# EAGLE design power-v2 (EAGLE 5.11)
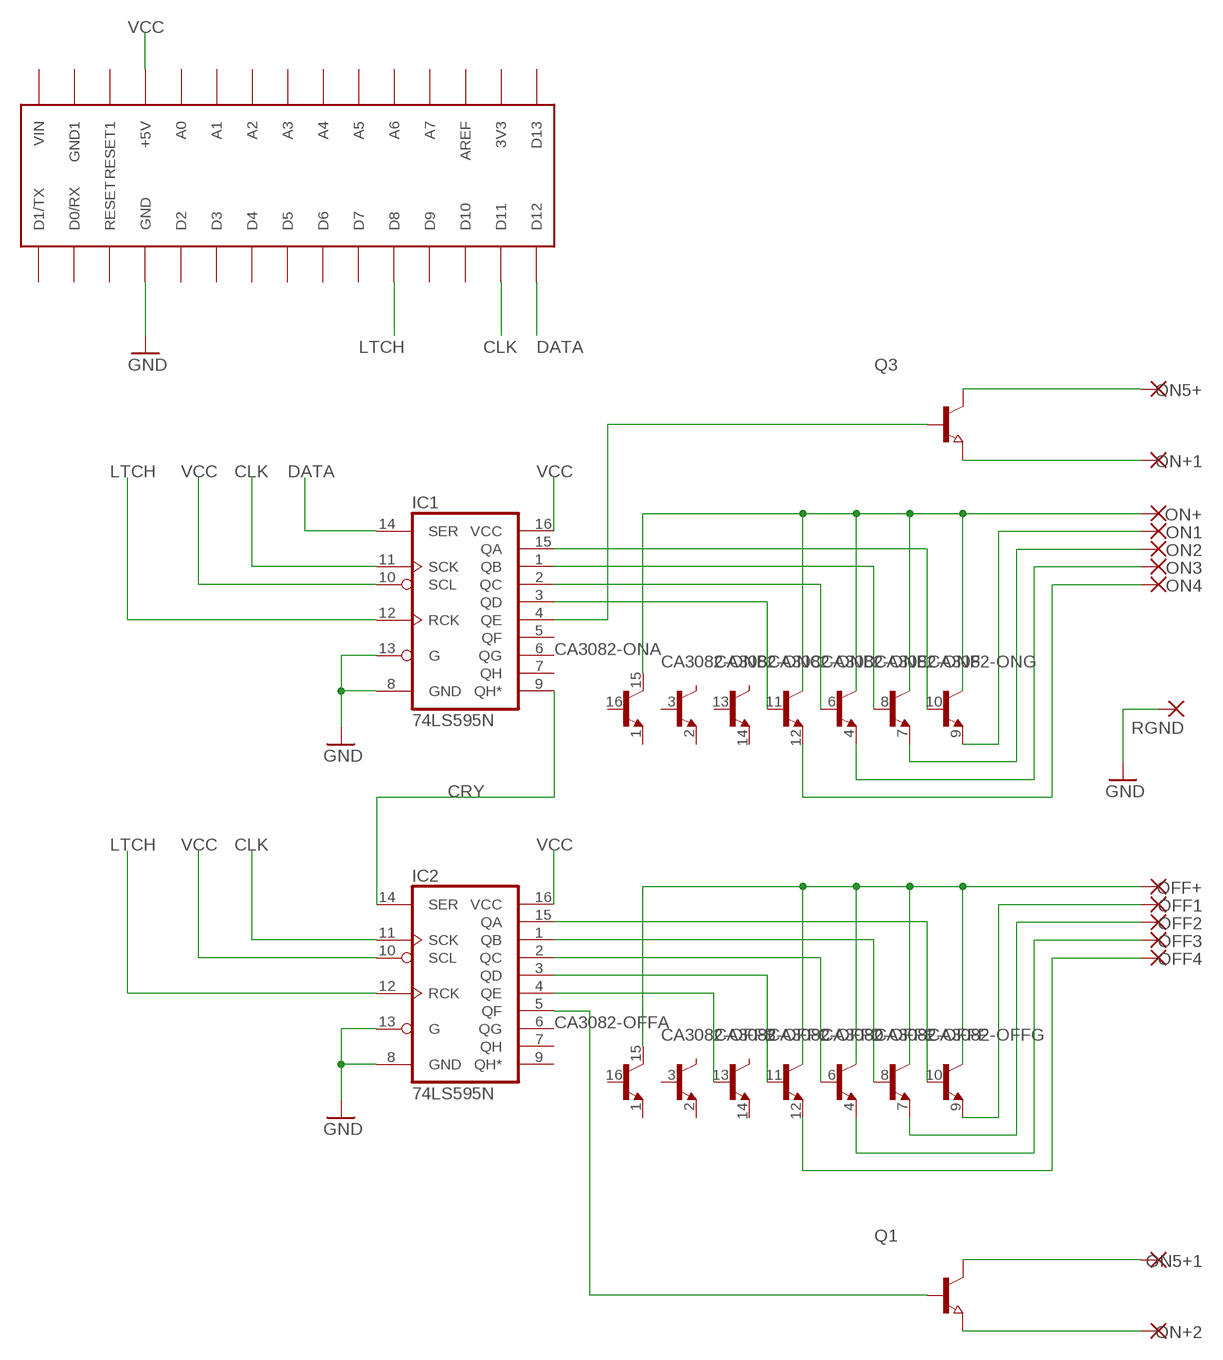
[diagram p0: schematic, sheet 1]

## Parts
CA3082-OFF  CA3082  [DIL16]
CA3082-ON  CA3082  [DIL16]
IC1  74LS595N  [DIL16]
IC2  74LS595N  [DIL16]
OFF1  1,6/0,8  [1,6/0,8]
OFF2  1,6/0,8  [1,6/0,8]
OFF3  1,6/0,8  [1,6/0,8]
OFF4  1,6/0,8  [1,6/0,8]
OFF+  1,6/0,8  [1,6/0,8]
ON1  1,6/0,8  [1,6/0,8]
ON2  1,6/0,8  [1,6/0,8]
ON3  1,6/0,8  [1,6/0,8]
ON4  1,6/0,8  [1,6/0,8]
ON5+  1,6/0,8  [1,6/0,8]
ON5+1  1,6/0,8  [1,6/0,8]
ON+  1,6/0,8  [1,6/0,8]
ON+1  1,6/0,8  [1,6/0,8]
ON+2  1,6/0,8  [1,6/0,8]
Q1  NPN-TRANSISTOR_SOT23  [SOT23]
Q3  NPN-TRANSISTOR_SOT23  [SOT23]
RGND  1,6/0,8  [1,6/0,8]
U$1  ARDUINONANO  [PDIP-32]

## Nets
CLK: IC1.11(SCK) IC2.11(SCK) U$1.D11
CRY: IC1.9(QH*) IC2.14(SER)
DATA: IC1.14(SER) U$1.D12
GND: IC1.8(GND) IC1.13(G) IC2.8(GND) IC2.13(G) RGND.1(P) U$1.GND
LTCH: IC1.12(RCK) IC2.12(RCK) U$1.D8
N$1: CA3082-ON.9(G:E) ON1.1(P)
N$2: CA3082-ON.7(F:E) ON2.1(P)
N$3: CA3082-ON.4(E:E) ON3.1(P)
N$4: CA3082-ON.12(D:E) ON4.1(P)
N$5: IC1.4(QE) Q3.1(B)
N$6: ON5+.1(P) Q3.3(C)
N$7: CA3082-OFF.13(C:B) IC2.4(QE)
N$8: CA3082-OFF.11(D:B) IC2.3(QD)
N$9: CA3082-OFF.6(E:B) IC2.2(QC)
N$10: CA3082-OFF.8(F:B) IC2.1(QB)
N$11: ON+1.1(P) Q3.2(E)
N$12: CA3082-ON.11(D:B) IC1.3(QD)
N$13: CA3082-ON.6(E:B) IC1.2(QC)
N$14: CA3082-ON.8(F:B) IC1.1(QB)
N$15: CA3082-ON.10(G:B) IC1.15(QA)
N$16: CA3082-OFF.10(G:B) IC2.15(QA)
N$17: IC2.5(QF) Q1.1(B)
N$18: ON5+1.1(P) Q1.3(C)
N$19: ON+2.1(P) Q1.2(E)
N$20: CA3082-OFF.9(G:E) OFF1.1(P)
N$21: CA3082-OFF.7(F:E) OFF2.1(P)
N$22: CA3082-OFF.4(E:E) OFF3.1(P)
N$23: CA3082-OFF.12(D:E) OFF4.1(P)
OFF+: CA3082-OFF.15(A:C) OFF+.1(P)
ON+: CA3082-ON.15(A:C) ON+.1(P)
VCC: IC1.10(SCL) IC1.16(VCC) IC2.10(SCL) IC2.16(VCC) U$1.+5V
Unconnected: CA3082-OFF.1(A:E) CA3082-OFF.2(B:E) CA3082-OFF.3(B:B) CA3082-OFF.14(C:E) CA3082-OFF.16(A:B) CA3082-ON.1(A:E) CA3082-ON.2(B:E) CA3082-ON.3(B:B) CA3082-ON.13(C:B) CA3082-ON.14(C:E) CA3082-ON.16(A:B) IC1.5(QF) IC1.6(QG) IC1.7(QH) IC2.6(QG) IC2.7(QH) IC2.9(QH*) U$1.3V3 U$1.A0 U$1.A1 U$1.A2 U$1.A3 U$1.A4 U$1.A5 U$1.A6 U$1.A7 U$1.AREF U$1.D0/RX U$1.D1/TX U$1.D2 U$1.D3 U$1.D4 U$1.D5 U$1.D6 U$1.D7 U$1.D9 U$1.D10 U$1.D13 U$1.GND1 U$1.RESET U$1.RESET1 U$1.VIN

## Library data of the parts
CA3082-OFF CA3082-ON = transistor:CA3082: TRANSISTOR ARRAY general purpose, high current common collector
IC1 IC2 = SparkFun:74*595: 8-bit SHIFT REGISTER, output latch
OFF1-OFF4 OFF+ ON1-ON4 ON5+ ON5+1 ON+ ON+1 ON+2 RGND = wirepad:1,6/0,8: THROUGH-HOLE PAD
Q1 Q3 = semicon-smd-ipc:NPN-TRANSISTOR_: NPN TRANSISTOR
U$1 = jet-lib:ARDUINONANO

## Board
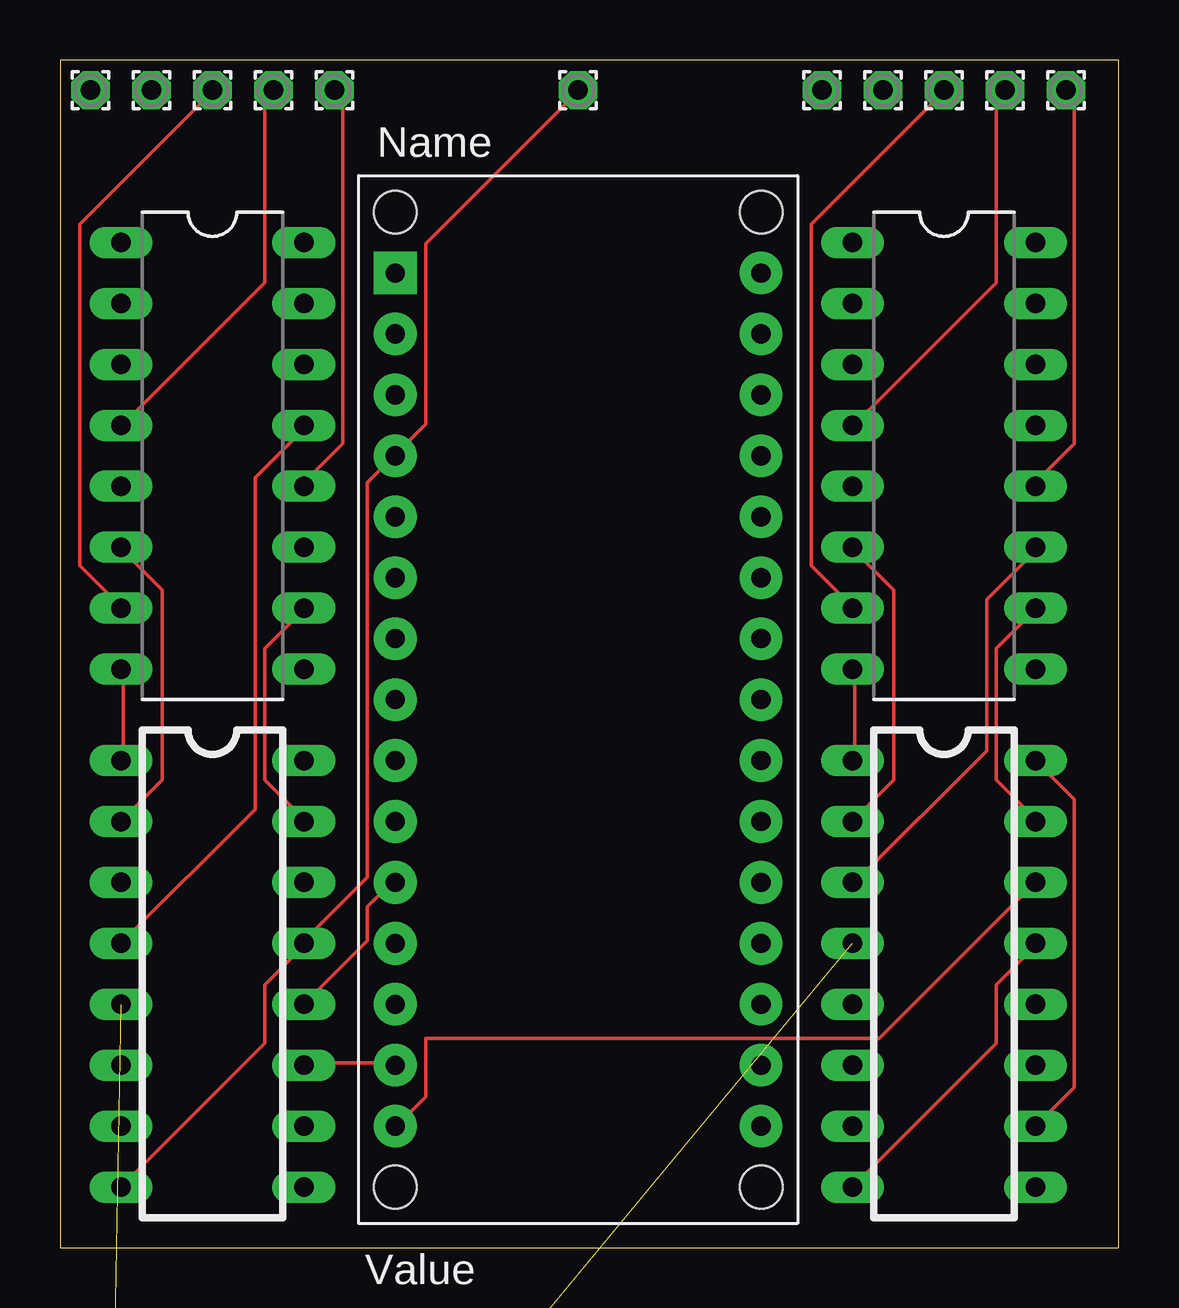
[diagram p1: board, top side]
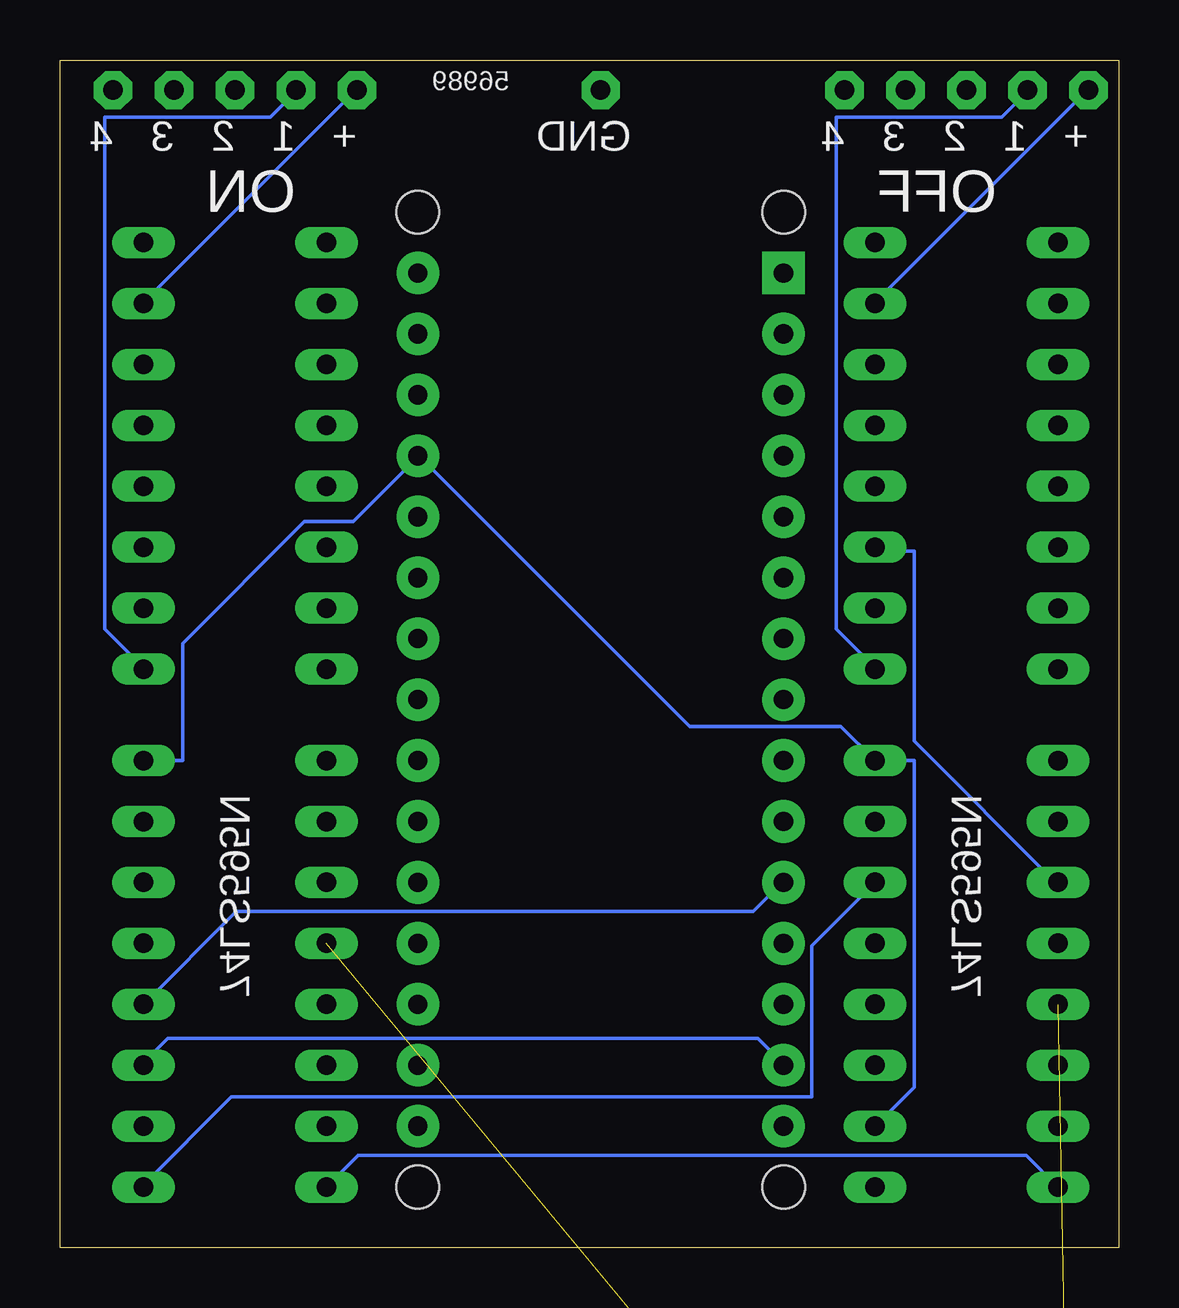
[diagram p2: board, bottom side, seen from below]

Size 44.12 x 49.52 mm. Coordinates in mm from the lower left corner, seen from the top.
Outline: 0,0 44.12,0 44.12,49.52 0,49.52 0,0
Copper layers (1*16): Top 0.035mm / dielectric 1.5mm / Bottom 0.035mm
Design rules "Fusion_eagle_rule_v1.1": minimum track width 6mil, minimum drill 12mil, track to track 6mil, track to pad 6mil, pad to pad 6mil, via to via 6mil, smd to smd 0mil, copper to edge 10mil, drill to drill 10mil, minimum pad ring 10mil, minimum via ring 6mil, stop-mask expansion 2mil, vias tented up to drill 100mil, thermal gap 10mil

### Footprints (pad centres in the part's own frame; a part is rotated, then mirrored left to right if it is on the bottom)
DIL16 = drill 0.813 long: 1 -8.89,-3.81; 2 -6.35,-3.81; 3 -3.81,-3.81; 4 -1.27,-3.81; 5 1.27,-3.81; 6 3.81,-3.81; 7 6.35,-3.81; 8 8.89,-3.81; 9 8.89,3.81; 10 6.35,3.81; 11 3.81,3.81; 12 1.27,3.81; 13 -1.27,3.81; 14 -3.81,3.81; 15 -6.35,3.81; 16 -8.89,3.81
1,6/0,8 = drill 0.813 pad 1.6 octagon: 1 0,0
SOT23 = smd 1 x 1.4: 1 -0.95,-1.1; 2 0.95,-1.1; 3 0,1.1
PDIP-32 = drill 0.8 pad 1.778 round: 3V3 15.24,-35.56; +5V 15.24,-10.16; A0 15.24,-12.7; A1 15.24,-15.24; A2 15.24,-17.78; A3 15.24,-20.32; A4 15.24,-22.86; A5 15.24,-25.4; A6 15.24,-27.94; A7 15.24,-30.48; AREF 15.24,-33.02; D0/RX 0,-5.08; D2 0,-12.7; D3 0,-15.24; D4 0,-17.78; D5 0,-20.32; D6 0,-22.86; D7 0,-25.4; D8 0,-27.94; D9 0,-30.48; D10 0,-33.02; D11 0,-35.56; D12 0,-38.1; D13 15.24,-38.1; GND 0,-10.16; GND1 15.24,-5.08; RESET 0,-7.62; RESET1 15.24,-7.62; VIN 15.24,-2.54 | drill 0.8 pad 1.778 square: D1/TX 0,-2.54 | hole 1.778: 0,0; 0,-40.64; 15.24,-40.64; 15.24,0

### Placement (x,y rotation side)
CA3082-OFF  6.35,33.02 270 top
CA3082-ON  36.83,33.02 270 top
IC1  36.83,11.43 270 top
IC2  6.35,11.43 270 top
OFF1  3.81,48.26 0 top
OFF2  6.35,48.26 0 top
OFF3  8.89,48.26 0 top
OFF4  11.43,48.26 0 top
OFF+  1.27,48.26 0 top
ON1  34.29,48.26 0 top
ON2  36.83,48.26 0 top
ON3  39.37,48.26 0 top
ON4  41.91,48.26 0 top
ON5+  1.27,-27.94 0 top  (outside the outline)
ON5+1  1.27,-45.72 0 top  (outside the outline)
ON+  31.75,48.26 0 top
ON+1  1.27,-33.02 0 top  (outside the outline)
ON+2  1.27,-50.8 0 top  (outside the outline)
Q1  2.54,-39.37 0 top  (outside the outline)
Q3  2.54,-24.13 0 top  (outside the outline)
RGND  21.59,48.26 0 top
U$1  13.97,43.18 0 top

### Tracks (layer width: path | path; a pad name or v marks a point on that pad's centre or on a via)
CLK
  Top 0.152: IC2.11 10.16,7.72 13.82,7.72 U$1.D11
  Bottom 0.152: IC1.11 40.64,7.72 39.62,8.74 15.04,8.74 14.02,7.72 U$1.D11
CRY
  Bottom 0.152: IC2.14 12.8,12.6 12.8,6.3 36.98,6.3 40.64,2.64 IC1.9
DATA
  Top 0.152: IC1.14 34.14,8.74 15.24,8.74 15.24,6.3 14.02,5.08 U$1.D12
GND
  Top 0.152: IC1.8 39.01,8.53 39.01,10.97 40.64,12.6 IC1.13 | IC2.8 8.53,8.53 8.53,10.97 10.16,12.6 IC2.13 10.16,12.8 12.8,15.44 12.8,31.9 13.82,32.92 U$1.GND 14.02,33.12 15.24,34.34 15.24,41.86 21.54,48.16 RGND.1
  Bottom 0.152: IC1.8 31.7,3.86 3.86,3.86 IC2.8
LTCH
  Top 0.152: IC2.12 12.8,12.8 12.8,14.22 13.82,15.24 U$1.D8
  Bottom 0.152: IC1.12 36.78,14.02 15.24,14.02 14.02,15.24 U$1.D8
N$1
  Bottom 0.152: CA3082-ON.9 40.64,24.18 42.27,25.81 42.27,47.14 35.36,47.14 34.34,48.16 ON1.1
N$2
  Top 0.152: CA3082-ON.7 32.92,26.82 31.29,28.45 31.29,42.67 36.78,48.16 ON2.1
N$3
  Top 0.152: CA3082-ON.4 33.12,34.34 39.01,40.23 39.01,47.95 39.22,48.16 ON3.1
N$4
  Top 0.152: CA3082-ON.12 40.64,31.9 42.27,33.53 42.27,47.95 42.06,48.16 ON4.1
N$5  (1 unrouted)
N$6  (1 unrouted)
N$7
  Top 0.152: IC2.4 8.13,18.29 8.13,32.11 10.16,34.14 CA3082-OFF.13
N$8
  Bottom 0.152: IC2.3 2.64,15.24 8.53,21.13 8.53,29.06 10.16,29.06 CA3082-OFF.11
N$9
  Top 0.152: IC2.2 4.27,19.51 4.27,27.43 2.64,29.06 CA3082-OFF.6
N$10
  Top 0.152: IC2.1 2.64,20.32 2.64,23.98 CA3082-OFF.8
N$11  (1 unrouted)
N$12
  Top 0.152: IC1.3 33.12,15.24 38.61,20.73 38.61,27.03 40.64,29.06 CA3082-ON.11
N$13
  Top 0.152: IC1.2 34.75,19.51 34.75,27.43 33.12,29.06 CA3082-ON.6
N$14
  Top 0.152: IC1.1 33.12,20.32 33.12,23.98 CA3082-ON.8
N$15
  Top 0.152: IC1.15 40.64,17.88 39.01,19.51 39.01,24.99 40.64,26.62 CA3082-ON.10
N$16
  Top 0.152: IC2.15 10.16,17.88 8.53,19.51 8.53,24.99 10.16,26.62 CA3082-OFF.10
N$17  (1 unrouted)
N$18  (1 unrouted)
N$19  (1 unrouted)
N$20
  Bottom 0.152: CA3082-OFF.9 10.16,24.18 11.79,25.81 11.79,47.14 4.88,47.14 3.86,48.16 OFF1.1
N$21
  Top 0.152: CA3082-OFF.7 2.44,26.82 0.81,28.45 0.81,42.67 6.3,48.16 OFF2.1
N$22
  Top 0.152: CA3082-OFF.4 2.64,34.34 8.53,40.23 8.53,47.95 8.74,48.16 OFF3.1
N$23
  Top 0.152: CA3082-OFF.12 10.16,31.9 11.79,33.53 11.79,47.95 11.58,48.16 OFF4.1
OFF+
  Bottom 0.152: CA3082-OFF.15 10.16,39.42 1.42,48.16 OFF+.1
ON+
  Bottom 0.152: CA3082-ON.15 40.64,39.42 31.9,48.16 ON+.1
VCC
  Top 0.152: IC1.10 42.27,6.71 42.27,18.69 IC1.16
  Bottom 0.152: IC2.10 8.53,6.71 8.53,20.32 IC2.16 11.58,21.74 17.88,21.74 29.06,32.92 U$1.+5V 29.26,32.92 31.9,30.28 33.93,30.28 39.01,25.2 39.01,20.32 IC1.16

### Text on the board
bNames: 56989 | + | 1 | 2 | 3 | 4 | GND | + | 1 | 2 | 3 | 4 | OFF | ON